# Altium project Additional_Circuit.PrjPcb
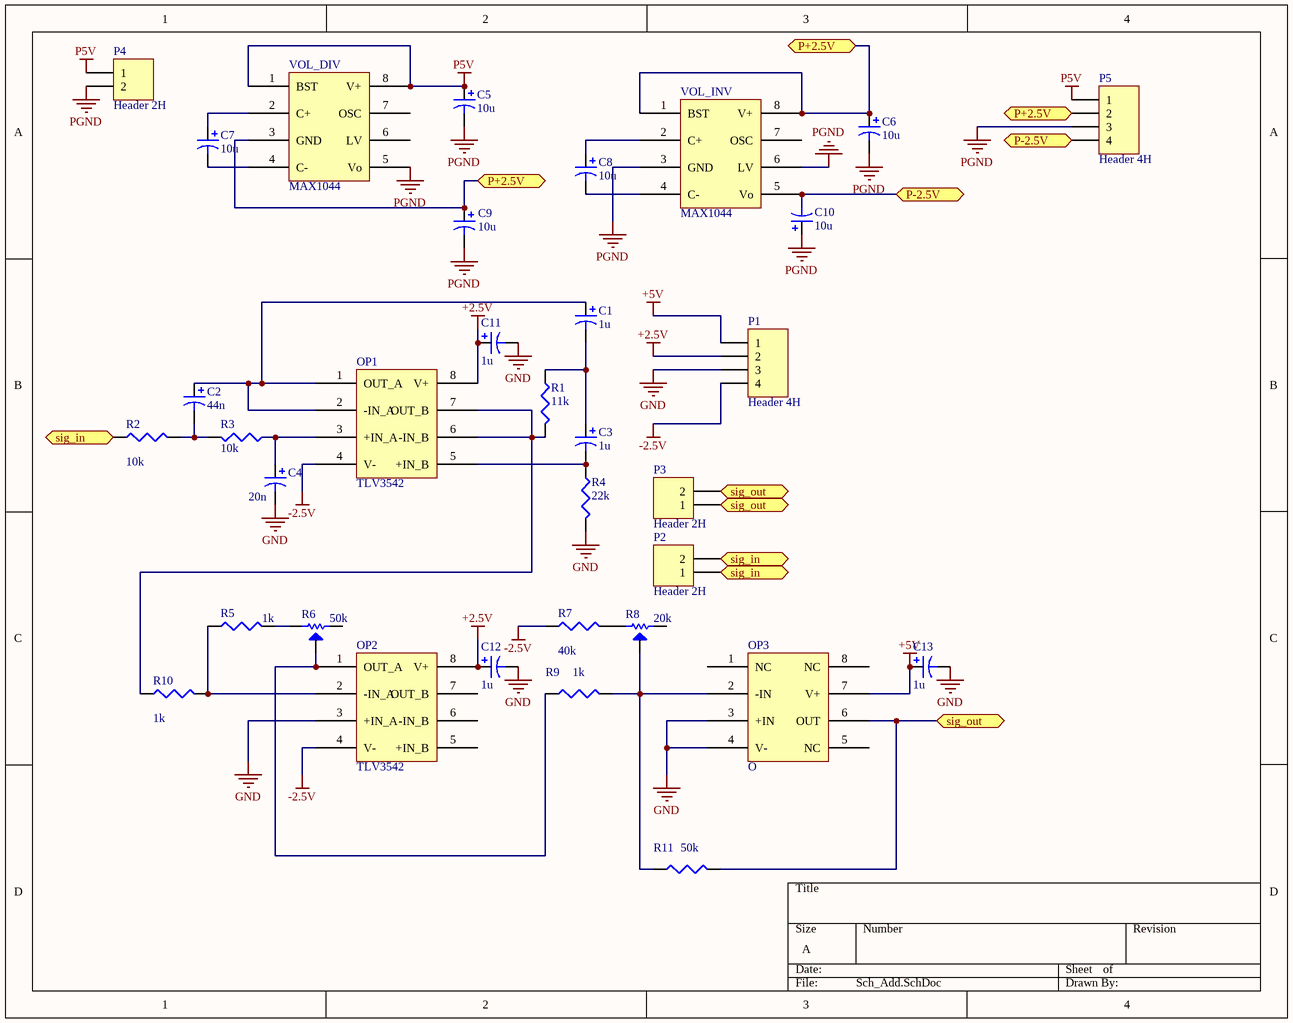
[diagram p0: Sch_Add.SchDoc]
1 sheet, 34 parts. Net scope: flat (ports and power ports of the same name join across sheets).
Board file: PCB_Add.PcbDoc

## Sheet Sch_Add.SchDoc
size A

### Parts
C1  value 1u  [C0805]  (hidden comment: Cap Pol3)
C2  value 44n  [C0805]  (hidden comment: Cap Pol3)
C3  value 1u  [C0805]  (hidden comment: Cap Pol3)
C4  value 20n  [C0805]  (hidden comment: Cap Pol3)
C5  value 10u  [C0805]  (hidden comment: Cap Pol3)
C6  value 10u  [C0805]  (hidden comment: Cap Pol3)
C7  value 10u  [C0805]  (hidden comment: Cap Pol3)
C8  value 10u  [C0805]  (hidden comment: Cap Pol3)
C9  value 10u  [C0805]  (hidden comment: Cap Pol3)
C10  value 10u  [C0805]  (hidden comment: Cap Pol3)
C11  value 1u  [C0805]  (hidden comment: Cap Pol3)
C12  value 1u  [C0805]  (hidden comment: Cap Pol3)
C13  value 1u  [C0805]  (hidden comment: Cap Pol3)
OP1  TLV3542  [SOIC127P600X175-8N]
OP2  TLV3542  [SOIC127P600X175-8N]
OP3  O  [SOIC127P600X175-8N]
P1  Header 4H  [HDR1X4H]
P2  Header 2H  [HDR1X2H]
P3  Header 2H  [HDR1X2H]
P4  Header 2H  [HDR1X2H]
P5  Header 4H  [HDR1X4H]
R1  value 11k  [J1-0603]  (hidden comment: Res3)
R2  value 10k  [J1-0603]  (hidden comment: Res3)
R3  value 10k  [J1-0603]  (hidden comment: Res3)
R4  value 22k  [J1-0603]  (hidden comment: Res3)
R5  value 1k  [J1-0603]  (hidden comment: Res3)
R6  value 50k  [3362P]  (hidden comment: 5)
R7  value 40k  [J1-0603]  (hidden comment: Res3)
R8  value 20k  [3362P]  (hidden comment: 2)
R9  value 1k  [J1-0603]  (hidden comment: Res3)
R10  value 1k  [J1-0603]  (hidden comment: Res3)
R11  value 50k  [J1-0603]  (hidden comment: Res3)
VOL_DIV  MAX1044  [SOIC127P600X175-8N]
VOL_INV  MAX1044  [SOIC127P600X175-8N]

### Ports
P+2.5V, P-2.5V, sig_in, sig_out

### Nets
+2.5V: C11.1 C12.1 OP1.8(V+) OP2.8(V+) P1.2
+5V: C13.1 OP3.7(V+) P1.1
-2.5V: OP1.4(V-) OP2.4(V-) P1.4 R7.1
GND: C4.2 C11.2 C12.2 C13.2 OP2.3(+IN_A) OP3.3(+IN) OP3.4(V-) P1.3 R4.2
P5V: C5.1 P4.1 P5.1 VOL_DIV.1(BST) VOL_DIV.8(V+)
PGND: C5.2 C6.2 C9.2 C10.1 P4.2 P5.3 VOL_DIV.5(Vo) VOL_INV.3(GND) VOL_INV.6(LV)
NetC1_1: C1.1 C2.1 OP1.1(OUT_A) OP1.2(-IN_A)
NetC1_2: C1.2 C3.1 R1.1
NetC2_2: C2.2 R2.2 R3.2
NetC3_2: C3.2 OP1.5(+IN_B) R4.1
NetC4_1: C4.1 OP1.3(+IN_A) R3.1
NetC6_1: C6.1 C9.1 P5.2 VOL_DIV.3(GND) VOL_INV.1(BST) VOL_INV.8(V+) ; port P+2.5V
NetC7_1: C7.1 VOL_DIV.2(C+)
NetC7_2: C7.2 VOL_DIV.4(C-)
NetC8_1: C8.1 VOL_INV.2(C+)
NetC8_2: C8.2 VOL_INV.4(C-)
NetC10_2: C10.2 P5.4 VOL_INV.5(Vo) ; port P-2.5V
NetOP1_6: OP1.6(-IN_B) OP1.7(OUT_B) R1.2 R10.1
NetOP2_1: OP2.1(OUT_A) R6.3 R9.1
NetOP2_2: OP2.2(-IN_A) R5.1 R10.2
NetOP3_2: OP3.2(-IN) R8.3 R9.2 R11.1
NetOP3_6: OP3.6(OUT) P3.1 P3.2 R11.2 ; port sig_out
NetP2_1: P2.1 P2.2 R2.1 ; port sig_in
NetR5_2: R5.2 R6.1
NetR7_2: R7.2 R8.1

Not connected (* = marked no-connect by the designer): OP2 5(+IN_B) 6(-IN_B) 7(OUT_B); OP3 1(NC) 5(NC) 8(NC); R6 2; R8 2; VOL_DIV 6(LV) 7(OSC); VOL_INV 7(OSC)

### Library data of the parts
C1-C13 = Cap Pol3: Polarized Capacitor (Surface Mount); Published: 8-Jun-2000; LatestRevisionDate: 29-May-2009; LatestRevisionNote: IPC-7351 Footprint Added.; PackageReference: C0805; Publisher: Altium Limited; PackageDescription: Chip Capacitor
OP3 = OPA388IDR
P1 P5 = Header 4H: Header, 4-Pin, Right Angle; LatestRevisionDate: 17-Jul-2002; LatestRevisionNote: Re-released for DXP Platform.; Publisher: Altium Limited
P2-P4 = Header 2H: Header, 2-Pin, Right Angle; LatestRevisionDate: 17-Jul-2002; LatestRevisionNote: Re-released for DXP Platform.; Publisher: Altium Limited
R1-R5 R7 R9-R11 = Res3: Resistor; Published: 8-Jun-2000; LatestRevisionDate: 29-May-2009; LatestRevisionNote: IPC-7351 Footprint Added.; PackageReference: J1-0603; Publisher: Altium Limited; PackageDescription: Chip Resistor
R6 R8 = Res_3362P